# Altium schematic sheet Voltage_Board.SchDoc
size A4; Author: Esteban Durán Madrid; CompanyName: Universidad de Santiago de Chile; Address1: Avenida Ecuador Nº 3519; Address2: Estación Central, Santiago; Address3: Chile; DocumentNumber: 1; SheetNumber: 1; SheetTotal: 3
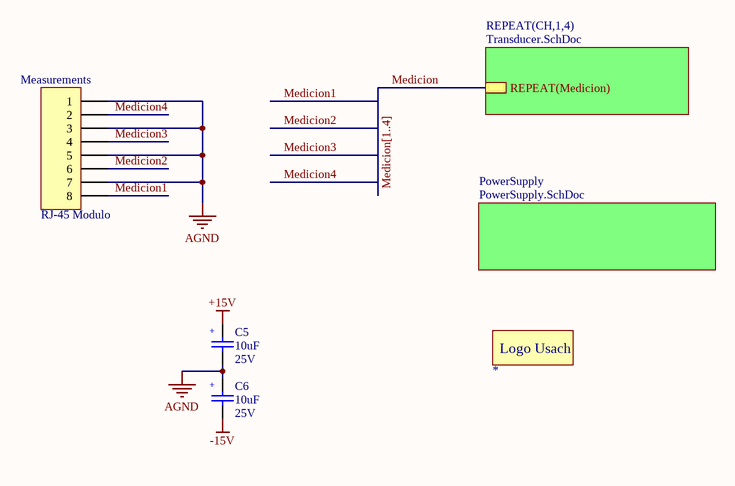
[diagram p0: Voltage_Board.SchDoc]

## Parts
*  LOGO USACH  [Logo Usach]  (value not drawn)
C5  10uF  Voltage: 25V  [CAP_1206 Tantalio]
C6  10uF  Voltage: 25V  [CAP_1206 Tantalio]
Measurements  RJ-45 Modulo  [RJ45 1 Modulo SMD]

## Sub-sheets
PowerSupply = PowerSupply.SchDoc: no entries
REPEAT(CH,1,4) = Transducer.SchDoc: REPEAT(Medicion)

## Nets
+15V: C5.1
-15V: C6.2
AGND: C5.2 C6.1 Measurements.1 Measurements.3 Measurements.5 Measurements.7
Medicion: sheet REPEAT(CH,1,4)/REPEAT(Medicion)
Medicion1: Measurements.8
Medicion2: Measurements.6
Medicion3: Measurements.4
Medicion4: Measurements.2

## Buses and harness runs
bus Medicion[1..4]

## Notes on the sheet
- Title
- Size:
- Date:
- A4
- Revision:
- Time:
- Sheet
- of
- Author:
- Project:
- (in symbol Cap Tantalio 1206) +
- (in symbol LOGO USACH) Logo Usach

## Library data of the parts
C5 C6 = Cap Tantalio 1206: Capacitor Tantalio; Manufacturer Part-Number: F951E106MAAAQ2; Digikey Part-Number: 478-8496-1-ND; Value: 10uF
Measurements = RJ45 1 modulo SMD: Modulo RJ-45 vertical SMD; Manufacturer Part-Number: 1-338088-3; LatestRevisionDate: 17-Jul-2002; LatestRevisionNote: Re-released for DXP Platform.; Publisher: Altium Limited; Digikey Part-Number: A99306CT-ND